# Altium schematic sheet Adaptor PCB.SchDoc
size 108 x 72 mm
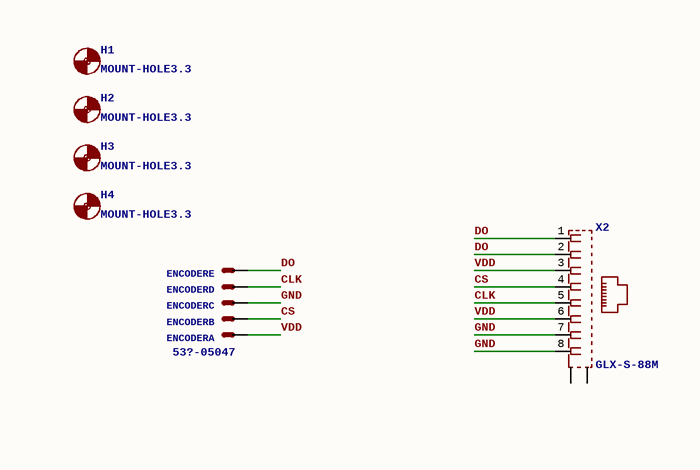
[diagram p0: Adaptor PCB.SchDoc]

## Parts
ENCODER  53?-05047  [53047-05]  (parts A,B,C,D,E of 5)
H1  MOUNT-HOLE3.3  [3,3]
H2  MOUNT-HOLE3.3  [3,3]
H3  MOUNT-HOLE3.3  [3,3]
H4  MOUNT-HOLE3.3  [3,3]
X2  GLX-S-88M  [GLX-S-88M]

## Nets
CLK: ENCODER.4(S) X2.5
CS: ENCODER.2(S) X2.4
DO: ENCODER.5(S) X2.1 X2.2
GND: ENCODER.3(S) X2.7 X2.8
VDD: ENCODER.1(S) X2.3 X2.6

Not connected (* = marked no-connect by the designer): X2 S1 S2

## Library data of the parts
ENCODER = 53?-05047: CONNECTORwire to board 1.25 mm (.049 inch) pitch header; MPN: 53047-0510; GateName_1: -1; SymbolName_1: MV; GateName_2: -2; SymbolName_2: M; GateName_3: -3; GateName_4: -4; GateName_5: -5; DeviceName: 047; DeviceSetName: 53?-05; MF: MOLEX; SymbolName_3: M; SymbolName_4: M; SymbolName_5: M; LibraryName: con-molex; OC_FARNELL: 9732861; OC_NEWARK: 38C9901
H1-H4 = MOUNT-HOLE3.3: MOUNTING HOLE with drill center marker; GateName_1: G$1; DeviceName: 3.3; SymbolName_1: MOUNT-HOLE; LibraryName: holes; DeviceSetName: MOUNT-HOLE
X2 = GLX-S-88M: Mod. Jack, Right Angle, 8 posiotion, 8 contatcs RJ45Source: GLX-S-88M.pdf; GateName_1: G$1; SymbolName_1: JACK8SH; LibraryName: con-kycon; DeviceSetName: GLX-S-88M; MF: *; MPN: *; OC_FARNELL: unknown; OC_NEWARK: unknown